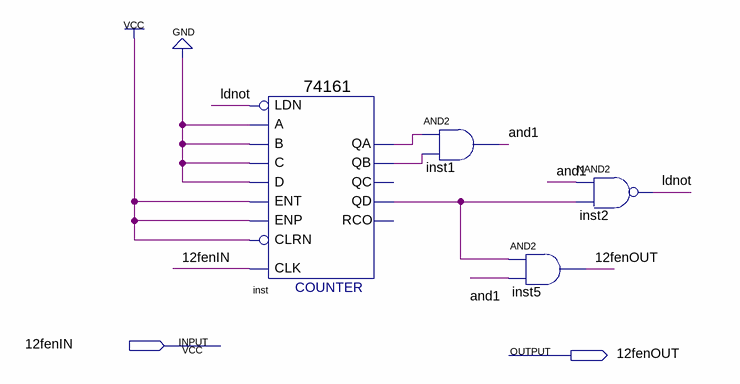
[diagram p0: schematic sheet]
// Quartus schematic 12fenpin.bdf as structural Verilog: 4 symbols, 2 pins
module \12fenpin  (
  input  \12fenIN ,
  output \12fenOUT 
);

  wire and1, inst_qa, inst_qb, inst_qd, ldnot;

  \74161  inst (
    .CLRN(1'b1), .CLK(\12fenIN ), .ENP(1'b1), .LDN(ldnot), .A(1'b0), .D(1'b0), .ENT(1'b1), .B(1'b0),
    .C(1'b0), .QD(inst_qd), .QB(inst_qb), .QA(inst_qa));  // open: QC, RCO
  and inst1 (and1, inst_qa, inst_qb);
  and inst5 (\12fenOUT , inst_qd, and1);
  nand inst2 (ldnot, and1, inst_qd);
endmodule
